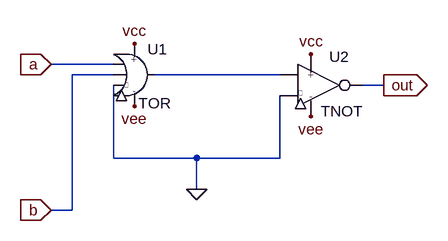
[diagram p0: schematic TNOR.asc]
TNOR.asc, the LTspice schematic file:
Version 4
SHEET 1 1456 680
WIRE 512 240 416 240
WIRE 512 256 448 256
WIRE 768 256 576 256
WIRE 928 272 896 272
WIRE 512 384 512 272
WIRE 640 384 512 384
WIRE 768 384 768 288
WIRE 768 384 640 384
WIRE 640 432 640 384
WIRE 448 464 448 256
WIRE 448 464 416 464
FLAG 416 240 a
IOPIN 416 240 In
FLAG 416 464 b
IOPIN 416 464 In
FLAG 640 432 0
FLAG 544 304 vee
FLAG 816 320 vee
FLAG 544 208 vcc
FLAG 816 224 vcc
FLAG 928 272 out
IOPIN 928 272 Out
SYMBOL TNOT 832 272 R0
SYMATTR InstName U2
SYMBOL TOR 544 256 R0
SYMATTR InstName U1

The netlist it stands for:
* TNOR.asc
XU2 N001 vcc vee out 0 TNOT  ; pins in vcc vee out gnd
XU1 a b vcc vee N001 0 TOR  ; pins a b vcc vee out gnd
.lib /Users/manoelribeiroalmeida/dev/trit/LTspice/TNOT.sub
.lib /Users/manoelribeiroalmeida/dev/trit/LTspice/TOR.sub
.backanno
.end